# Altium schematic sheet Power.SchDoc
size A4; SheetNumber: 2; SheetTotal: 8
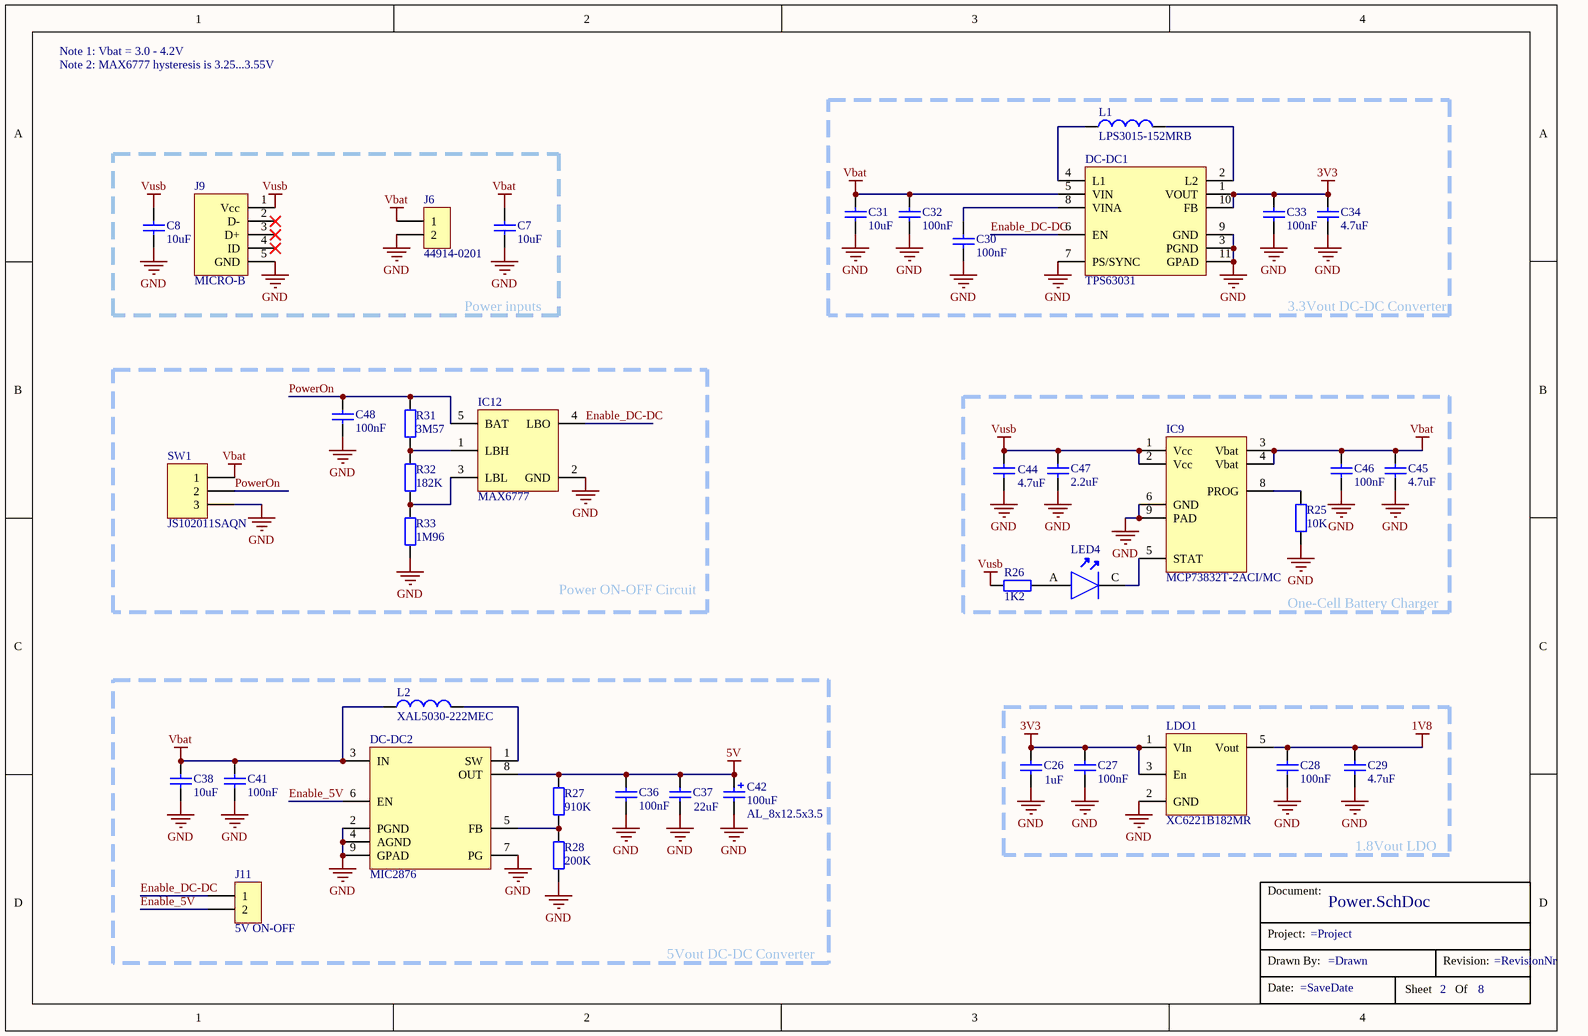
[diagram p0: Power.SchDoc]

## Parts
*  TitleBox  (value not drawn)
C7  Capacitance: 10uF  [C1206 N]
C8  Capacitance: 10uF  [C1206 N]
C26  Capacitance: 1uF  [C0603 N]
C27  Capacitance: 100nF  [C0603 N]
C28  Capacitance: 100nF  [C0603 N]
C29  Capacitance: 4.7uF  [C0603 N]
C30  Capacitance: 100nF  [C0603 N]
C31  Capacitance: 10uF  [C1206 N]
C32  Capacitance: 100nF  [C0603 N]
C33  Capacitance: 100nF  [C0603 N]
C34  Capacitance: 4.7uF  [C0603 N]
C36  Capacitance: 100nF  [C0603 N]
C37  Capacitance: 22uF  [C1206 N]
C38  Capacitance: 10uF  [C1206 N]
C41  Capacitance: 100nF  [C0603 N]
C42  Capacitance: 100uF  [AL_8x12.5x3.5]
C44  Capacitance: 4.7uF  [C1206 N]
C45  Capacitance: 4.7uF  [C1206 N]
C46  Capacitance: 100nF  [C0603 N]
C47  Capacitance: 2.2uF  [C0603 N]
C48  Capacitance: 100nF  [C0603 N]
DC-DC1  TPS63031  [WSON10, 2.6x2.6, LEAST]
DC-DC2  MIC2876  [QFN-8 2x2MM, NOMINAL]
IC9  MCP73832T-2ACI/MC  [DFN-8, 2X3MM]
IC12  MAX6777  [SOT323-5, Nominal]
J6  44914-0201  [44914-0201]
J9  MICRO-B  [MICRO-B]
J11  5V ON-OFF  [Male 1x2 vertical]
L1  LPS3015-152MRB  [LPS3010]
L2  XAL5030-222MEC  [XAL5030-222MEC]
LDO1  XC6221B182MR  [SOT-23-5, Nominal]
LED4  DebugLED1  [0603 NOMINAL]  (value not drawn)
R25  10K  [R0603]
R26  1K2  [R0603]
R27  910K  [R0603]
R28  200K  [R0603]
R31  3M57  [R0603]
R32  182K  [R0603]
R33  1M96  [R0603]
SW1  JS102011SAQN  [JS102011SAQN]

## Blocks framed on the sheet
3.3Vout DC-DC Converter: C30-C34 DC-DC1 L1
Power inputs: C7 C8 J6 J9
Power ON-OFF Circuit: C48 IC12 R31-R33 SW1
One-Cell Battery Charger: C44-C47 IC9 LED4 R25 R26
5Vout DC-DC Converter: C36-C38 C41 C42 DC-DC2 J11 L2 R27 R28
1.8Vout LDO: C26-C29 LDO1

## Nets
1V8: C28.2 C29.2 LDO1.5(Vout)
3V3: C26.2 C27.2 C33.2 C34.2 DC-DC1.1(VOUT) DC-DC1.10(FB) LDO1.1(VIn) LDO1.3(En)
5V: C36.2 C37.2 C42.1 DC-DC2.8(OUT) R27.2
GND: C7.1 C8.1 C26.1 C27.1 C28.1 C29.1 C30.1 C31.1 C32.1 C33.1 C34.1 C36.1 C37.1 C38.1 C41.1 C42.2 C44.1 C45.1 C46.1 C47.1 C48.1 DC-DC1.3(PGND) DC-DC1.7(PS/SYNC) DC-DC1.9(GND) DC-DC1.11(GPAD) DC-DC2.2(PGND) DC-DC2.4(AGND) DC-DC2.7(PG) DC-DC2.9(GPAD) IC9.6(GND) IC9.9(PAD) IC12.2(GND) J6.2 J9.5(GND) LDO1.2(GND) R25.2 R28.1 R33.2 SW1.3
Vbat: C7.2 C31.2 C32.2 C38.2 C41.2 C45.2 C46.2 DC-DC1.5(VIN) DC-DC2.3(IN) IC9.3(Vbat) IC9.4(Vbat) J6.1 L2.1 SW1.1
Vusb: C8.2 C44.2 C47.2 IC9.1(Vcc) IC9.2(Vcc) J9.1(Vcc) R26.1
Enable_5V: DC-DC2.6(EN) J11.2
Enable_DC-DC: DC-DC1.6(EN) IC12.4(LBO) J11.1
PowerOn: C48.2 IC12.5(BAT) R31.1 SW1.2
NetC30_2: C30.2 DC-DC1.8(VINA)
NetDC-DC1_2: DC-DC1.2(L2) L1.2
NetDC-DC1_4: DC-DC1.4(L1) L1.1
NetDC-DC2_1: DC-DC2.1(SW) L2.2
NetDC-DC2_5: DC-DC2.5(FB) R27.1 R28.2
NetIC9_5: IC9.5(STAT) LED4.C
NetIC9_8: IC9.8(PROG) R25.1
NetIC12_1: IC12.1(LBH) R31.2 R32.1
NetIC12_3: IC12.3(LBL) R32.2 R33.1
NetLED4_A: LED4.A R26.2

Not connected (* = marked no-connect by the designer): J9 2(D-)* 3(D+)* 4(ID)*

## Notes on the sheet
- Note 1: Vbat = 3.0 - 4.2V
- Note 2: MAX6777 hysteresis is 3.25...3.55V
- (in symbol TitleBox) Document:; Project:; Drawn By:; Revision:; Date:; Sheet; Of

## Library data of the parts
C7 C8 C26-C34 C36-C38 C41 C44-C48 = Capacitor: Ceramic capacitor; Type: MLCC; Voltage rating: *V; Characteristic: *; Manufacturer: *
  C7 C8 C31 C37 C38 C44 C45: Note: C1206 N
  C26-C30 C32-C34 C36 C41 C46-C48: Note: C0603 N
C42 = Capacitor Polarized: Polarized Capacitor; Voltage rating: *V; ESR: *R; Temp MAX: *C; Temp MIN: *C; Manufacturer: *; Note: AL_8x12.5x3.5
DC-DC1 = TPS63031: DC-DC CONVERTER, 3.3Vout, 1.8...5.5Vin, buck-boost, 800mA, TPS63031, TEXAS INSTRUMENTS; ComponentLink1Description: Datasheet; ComponentLink1URL: http://www.ti.com/lit/ds/symlink/tps63030.pdf
DC-DC2 = MIC2876: DC-DC CONVERTER, ADJ, Vin...5.5Vout, 2.5...5.5Vin, 4.8A, boost, MIC2875, Microchip; ComponentLink1Description: Datasheet; ComponentLink1URL: http://ww1.microchip.com/downloads/en/DeviceDoc/20005549A.pdf
IC9 = MCP73832T-2ACI: Battery Charger, 1 Cell of Li-Ion, Li-Pol, 3.75...6Vin, 15...500mA, 4.2Vout, DFN-8, MCP73832T-2ACI/MC, MICROCHIP; Output Current: 505mA; Output Voltage: 4.2V; Supply Voltage Range: 3.75 .. 6V; Operating Supply Current: 510uA; Supplier 1: Farnell; Manufacturer: Microchip; Manufacturer Part Number: MCP73832T-2ACI/MC; Operating Temperature Range: -40 .. 85°C; ComponentLink1URL: http://www.microchip.com/mymicrochip/filehandler.aspx?ddocname=en026002&src-supplier=Digi-Key; ComponentLink1Description: Datasheet; Supplier 2: Mouser; Supplier Part Number 1: 2857755RL; Supplier Part Number 2: 579-MCP73832T-2ACIMC
IC12 = MAX6777: Battery monitor, 1 cell, Li-ion, adj hysteresis, 1.0...5.5Vin, MAX6777, Maxim; ComponentLink1Description: Datasheet; ComponentLink1URL: http://www.farnell.com/datasheets/702614.pdf?_ga=2.184496931.465896120.1585759027-1429076973.1585049483
J6 = 44914-0201: MicroFit 2-pin CPI Header, 2 Row, Vertical; Manufacturer: Molex; Number of Positions: 2; Current Rating: 5A; Voltage Rating: 250V; Pitch: 3mm; Glow Wire Compliant: Compliant; Supplier 1: Mouser; Manufacturer Part Number: 44914-0201; Stock 1: 1889; Mount: Through Hole; Contact Plating: Tin; Color: Black; Housing Material: Thermoplastic; Operating Temperature: -40...105°C; Package Quantity: 3168; Number of Rows: 2; Packaging: Tray; Termination: Solder; Number of Contacts: 2; Orientation: Vertical; Voltage Rating (DC): 250V; Number of Circuits: 2; Row Spacing: 3mm; REACH SVHC: No SVHC; Halogen Free: Low Halogen; Flammability Rating: UL94 V-0; ComponentLink1URL: http://www.mouser.com/ds/2/276/0449140201_PCB_HEADERS-146076.pdf?src-supplier=Mouser; ComponentLink1Description: http://www.mouser.com/ds/2/276/0449140201_PCB_HEADERS-146076.pdf?src-supplier=Mouser; ComponentLink2URL: http://www.onlinecomponents.com/productFiles/mf-MOL/0449140201_pcb_headers.pdf?src-supplier=Onlinecomponents.com; ComponentLink2Description: http://www.onlinecomponents.com/productFiles/mf-MOL/0449140201_pcb_headers.pdf?src-supplier=Onlinecomponents.com; Supplier Part Number 1: 538-44914-0201
J9 = MICRO-B: Micro USB 2.0 type B, receptacle; Manufacturer: Molex; Manufacturer Part Number: 47346-1001; Pitch: 0.65mm; Supplier 1: Farnell; Operating Temperature Range: -30 .. 85°C; Orientation: Right Angle; Supplier 2: Mouser; Supplier Part Number 2: 538-47346-1001; Supplier Part Number 1: 2779944; ComponentLink1Description: Datasheet; ComponentLink1URL: http://www.farnell.com/datasheets/2696879.pdf
J11 = header 1x2 vertical
L1 = LPS3015-152MRB: Inductor, 1.5uH, 100mR, 1.3A, LPS3015-152MRB, COILCRAFT; ComponentLink1Description: Datasheet; ComponentLink1URL: http://www.farnell.com/datasheets/1805321.pdf?_ga=2.252438669.562777961.1586113222-1429076973.1585049483
L2 = XAL5030-222MEC: Inductor, 2.2uH, 14mR, 9.2A, Coilcraft, XAL5030-222MEC; ComponentLink1Description: Datasheet; ComponentLink1URL: http://www.farnell.com/datasheets/1681990.pdf?_ga=2.217580054.1886183070.1585497363-1429076973.1585049483
LDO1 = XC6221B182MR: LDO, 1.8Vout, 1.6-6Vin, SOT-25, SMD,  HIGH SPEED LOW NOISE, TOREX - XC6221B182MR; Input Voltage Max: 6V; Fixed Output Voltage Nom.: 1.8V; Dropout Voltage Vdo: 0.125V @ 100mA; Accuracy %: 2%; Output Current Max: 200mA; Supplier 1: Farnell; Manufacturer: TOREX; Manufacturer Part Number: XC6221B182MR; LDO Regulator Case Style: SOT-25; Operating Temperature Range: -40°C to +85; Supplier 2: Digi-Key; Current - Output: 200mA; ComponentLink2URL: http://www.torex.co.jp/english/products/voltage_regulators/data/XC6221.pdf; ComponentLink2Description: Datasheet; Supplier Part Number 1: 1454268; Supplier Part Number 2: 893-1096-6-ND
LED4 = Generic LED: SMD mono-color Chip LED; Color: Green
R25-R28 R31-R33 = Resistor: Precision: *%; Voltage rating: *V; Temp coefficient: *ppm; Power rating: *mW; Manufacturer: *; Note: R0603
  R25: Resistance: 10K
  R26: Resistance: 1K2
  R27: Resistance: 910K
  R28: Resistance: 200K
  R31: Resistance: 3M57
  R32: Resistance: 182K
  R33: Resistance: 1M96
SW1 = JS102011SAQN: Manufacturer: ITT C&K; Max Voltage Rating (DC): 6V; Current Rating: 300mA; Contact Resistance: 70mR; Electrical Life: 5000Cycles; Switch Function: On-On; Supplier 1: Farnell; Manufacturer Part Number: JS102011SAQN; Mount: Surface Mount; Operating Temperature Range: -40 .. 85°C; Voltage Rating (DC): 6V; Contact Current Rating: 300mA; Orientation: Right Angle; ComponentLink1URL: http://www.farnell.com/datasheets/2044601.pdf?src-supplier=Element14; ComponentLink1Description: Datasheet; ComponentLink2URL: http://www1.futureelectronics.com/doc/C%20-%20K%20COMPONENTS/JS102011SAQN.pdf?src-supplier=Future+Electronics; ComponentLink2Description: http://www1.futureelectronics.com/doc/C%20-%20K%20COMPONENTS/JS102011SAQN.pdf?src-supplier=Future+Electronics; ComponentLink3URL: https://www.verical.com/server-webapp/html/getDatasheet?partID=313004&src-supplier=Verical; ComponentLink3Description: https://www.verical.com/server-webapp/html/getDatasheet?partID=313004&src-supplier=Verical; ComponentLink4URL: https://www.ckswitches.com/media/1422/js.pdf?src-supplier=Digi-Key; ComponentLink4Description: https://www.ckswitches.com/media/1422/js.pdf?src-supplier=Digi-Key; ComponentLink5URL: http://www.ck-components.com/14398/js_1nov12.pdf/?src-supplier=Avnet; ComponentLink5Description: http://www.ck-components.com/14398/js_1nov12.pdf/?src-supplier=Avnet; ComponentLink6URL: http://www.ck-components.com/14398/js_1nov12.pdf/?src-supplier=Avnet+Europe; ComponentLink6Description: http://www.ck-components.com/14398/js_1nov12.pdf/?src-supplier=Avnet+Europe; ComponentLink7URL: http://www.mouser.com/ds/2/60/JS_7jan16-221285.pdf?src-supplier=Mouser; ComponentLink7Description: http://www.mouser.com/ds/2/60/JS_7jan16-221285.pdf?src-supplier=Mouser; Supplier Part Number 1: 2320017RL; Supplier Prt Number 1: 2320017